# Altium schematic sheet Ethernet_Con.SchDoc: Ethernet Con
size A4
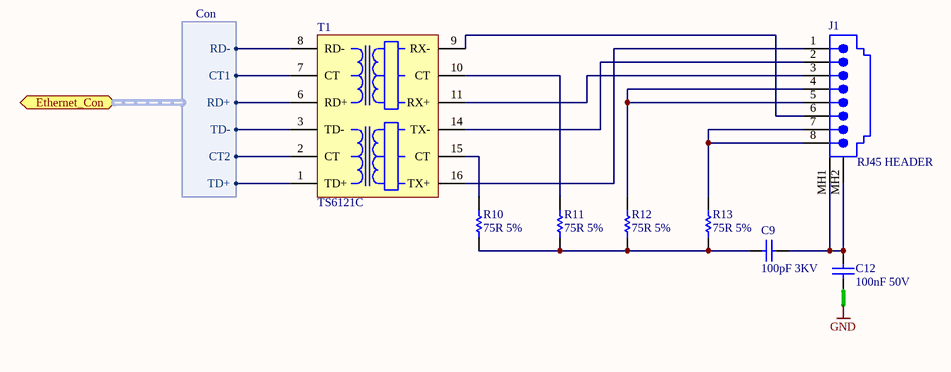
[diagram p0: Ethernet_Con.SchDoc]

## Parts
C9  100pF 3KV  [CAPR7_5-3_6x7_5]
C12  100nF 50V  [CAPC2012]
J1  RJ45 HEADER  [95122-2881]
R10  75R 5%  [RESC2012]
R11  75R 5%  [RESC2012]
R12  75R 5%  [RESC2012]
R13  75R 5%  [RESC2012]
T1  TS6121C  [SOIC127P910-16]

## Ports
Ethernet_Con (harness Con)

## Harnesses
Con: RD-, CT1, RD+, TD-, CT2, TD+

## Nets
GND: C12.1
NetC9_1: C9.1 R10.2 R11.2 R12.2 R13.2
NetC9_2: C9.2 C12.2 J1.MH1(Shield) J1.MH2(Shield)
NetJ1_1: J1.1 T1.16(TX+)
NetJ1_2: J1.2 T1.14(TX-)
NetJ1_3: J1.3 T1.11(RX+)
NetJ1_4: J1.4 J1.5 R12.1
NetJ1_6: J1.6 T1.9(RX-)
NetJ1_7: J1.7 J1.8 R13.1
NetR10_1: R10.1 T1.15(CT)
NetR11_1: R11.1 T1.10(CT)
NetT1_1: T1.1(TD+) ; port Ethernet_Con.TD+
NetT1_2: T1.2(CT) ; port Ethernet_Con.CT2
NetT1_3: T1.3(TD-) ; port Ethernet_Con.TD-
NetT1_6: T1.6(RD+) ; port Ethernet_Con.RD+
NetT1_7: T1.7(CT) ; port Ethernet_Con.CT1
NetT1_8: T1.8(RD-) ; port Ethernet_Con.RD-

## Notes on the sheet
- Title
- Size:
- Date:
- A4
- Number:
- Time:
- Revision:
- Sheet
- of
- File:

## Library data of the parts
C9 C12 = CAP-NP: Capacitor
J1 = CON-RJ45-10-RA: Right Angle, Standard Profile, External Shield PCB Jack
R10-R13 = RES: Resistor
T1 = TS6121C: Bothhand 10/100 BaseT Pulse Transformer